# EAGLE schematic psu (EAGLE 7.4.0)
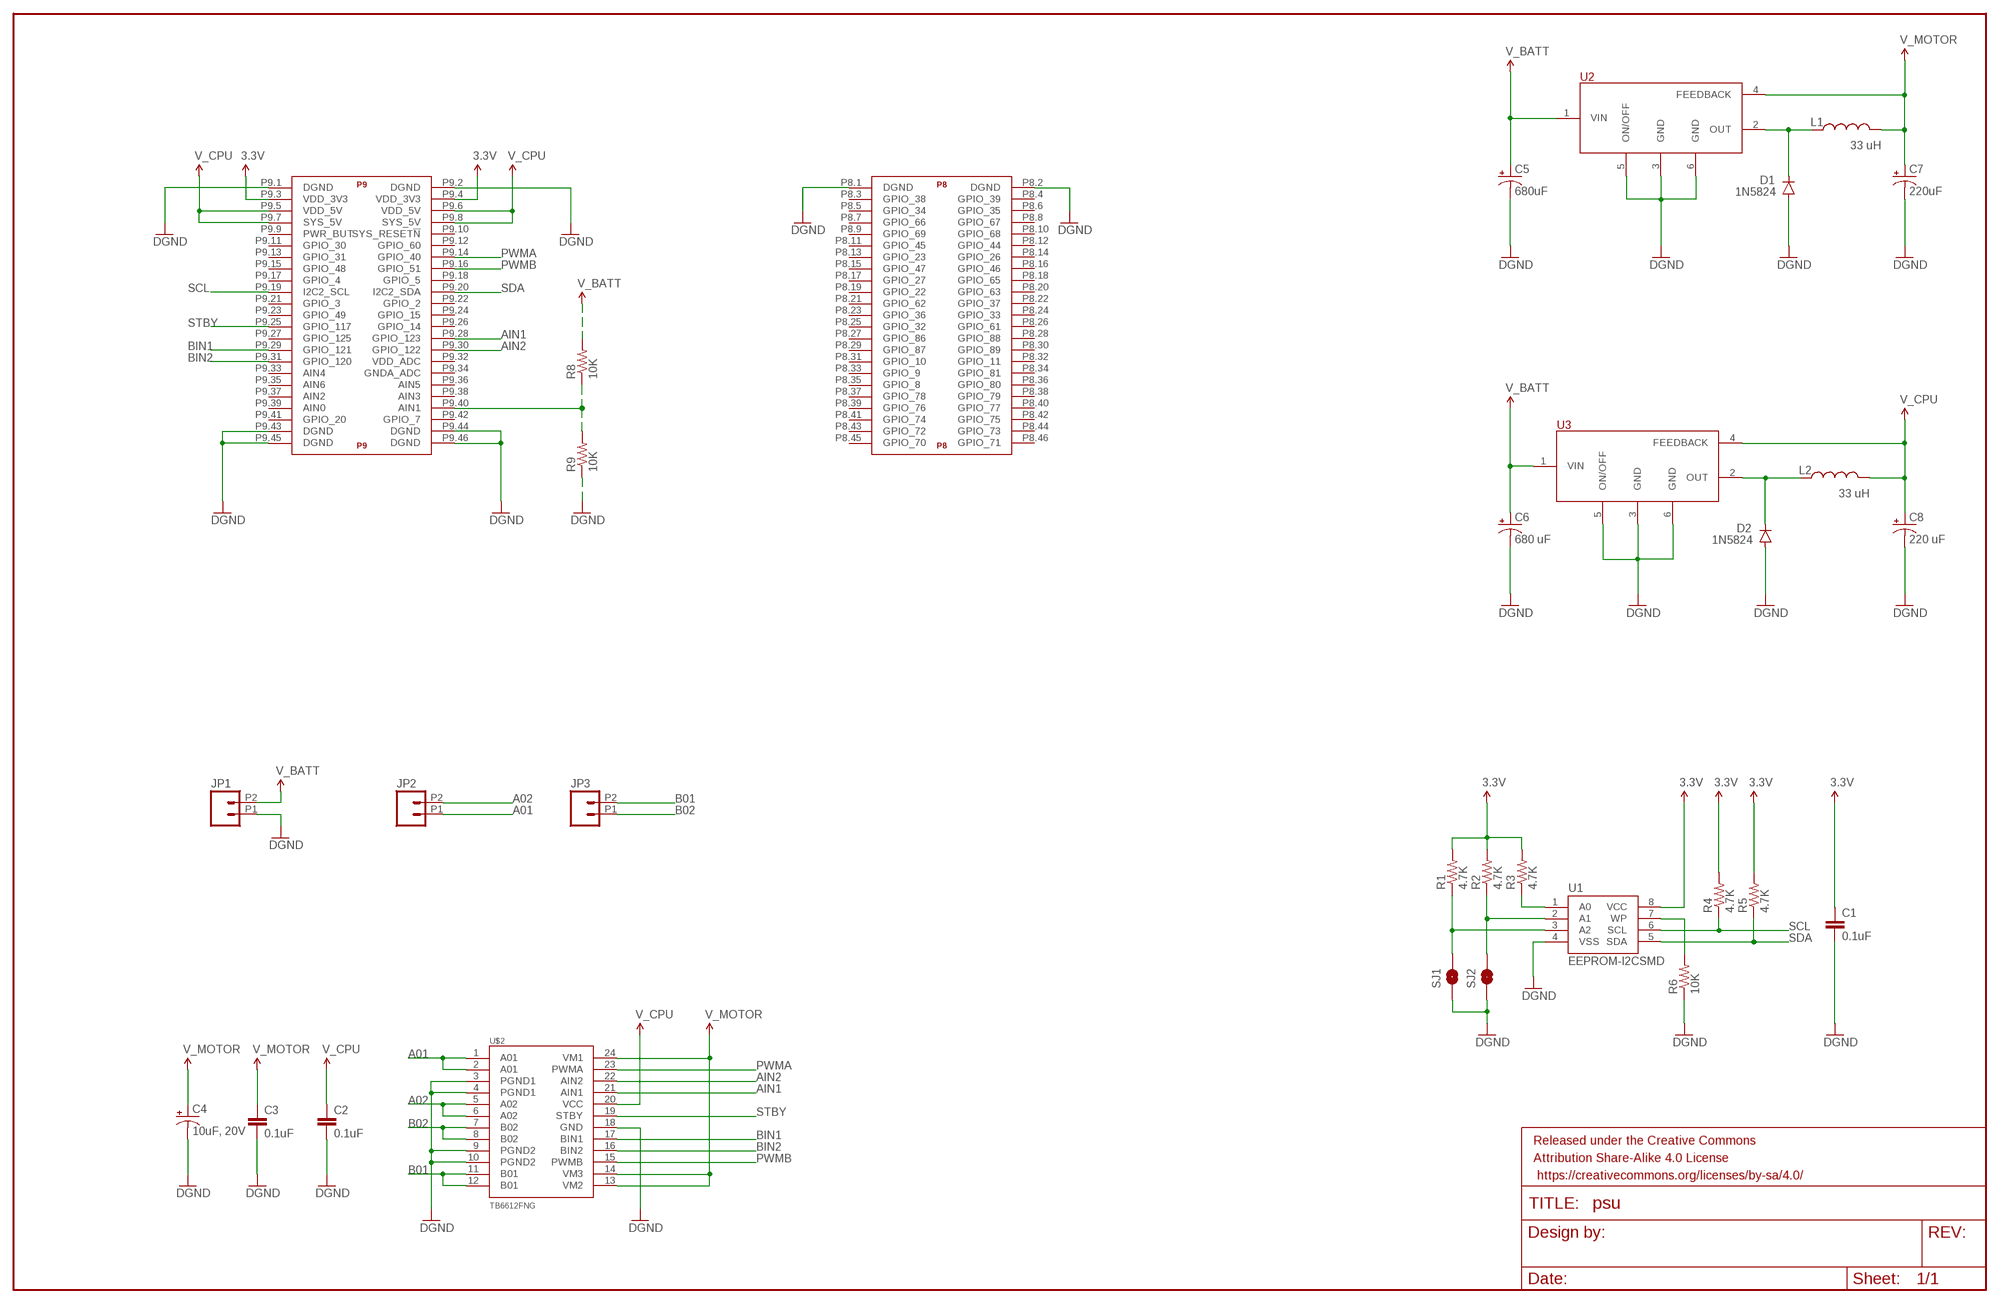
[diagram p0: schematic, sheet 1]

## Parts
C1  0.1uF  0.1UF-25V(+80/-20%)(0603)  [0603-CAP]
C2  0.1uF  0.1UF-25V(+80/-20%)(0603)  [0603-CAP]
C3  0.1uF  0.1UF-25V(+80/-20%)(0603)  [0603-CAP]
C4  10uF, 20V  10UF-25V-20%(PTH)KIT  [CPOL-RADIAL-10UF-25V-KIT]
C5  680uF  CAP_POLPTH2  [CPOL-RADIAL-10UF-25V]
C6  680 uF  CAP_POLPTH2  [CPOL-RADIAL-10UF-25V]
C7  220uF  CAP_POLPTH2  [CPOL-RADIAL-10UF-25V]
C8  220 uF  CAP_POLPTH2  [CPOL-RADIAL-10UF-25V]
D1  1N5824  DIODEPTH  [DIODE-1N4001]
D2  1N5824  DIODEPTH  [DIODE-1N4001]
FRAME2  FRAME-LEDGER  [CREATIVE_COMMONS]
JP1  M022.54MM_SCREWTERM  [1X02_2.54_SCREWTERM]
JP2  M022.54MM_SCREWTERM  [1X02_2.54_SCREWTERM]
JP3  M022.54MM_SCREWTERM  [1X02_2.54_SCREWTERM]
L1  33 uH  INDUCTOR0603  [0603]
L2  33 uH  INDUCTOR0603  [0603]
R1  4.7K  4.7KOHM-1/10W-1%(0603)  [0603-RES]
R2  4.7K  4.7KOHM-1/10W-1%(0603)  [0603-RES]
R3  4.7K  4.7KOHM-1/10W-1%(0603)  [0603-RES]
R4  4.7K  4.7KOHM-1/10W-1%(0603)  [0603-RES]
R5  4.7K  4.7KOHM-1/10W-1%(0603)  [0603-RES]
R6  10K  10KOHM-1/10W-1%(0603)0603  [0603-RES]
R8  10K  10KOHM-1/10W-1%(0603)0603  [0603-RES]
R9  10K  10KOHM-1/10W-1%(0603)0603  [0603-RES]
SJ1  JUMPER-PAD-2-NO  [PAD-JUMPER-2-NO_NO_SILK]
SJ2  JUMPER-PAD-2-NO  [PAD-JUMPER-2-NO_NO_SILK]
U1  EEPROM-I2CSMD  [SO08]
U2  LM2596  [TO-263]
U3  LM2596  [TO-263]
U$1  BEAGLE_BONE_BLACK_CAPE  [BEAGLE_BONE_BLACK_CAPE]
U$2  TB6612FNG  [SSOP24]

## Nets
3.3V: C1.1 R1.2 R2.2 R3.2 R4.2 R5.2 U1.8(VCC) U$1.P9.3(P9:VDD_3V3) U$1.P9.4(P9:VDD_3V3)
A01: JP2.P1 U$2.1(A01) U$2.2(A01)
A02: JP2.P2 U$2.5(A02) U$2.6(A02)
AIN1: U$1.P9.28(P9:GPIO_123) U$2.21(AIN1)
AIN2: U$1.P9.30(P9:GPIO_122) U$2.22(AIN2)
B01: JP3.P2 U$2.11(B01) U$2.12(B01)
B02: JP3.P1 U$2.7(B02) U$2.8(B02)
BIN1: U$1.P9.29(P9:GPIO_121) U$2.17(BIN1)
BIN2: U$1.P9.31(P9:GPIO_120) U$2.16(BIN2)
GND: C1.2 C2.2 C3.2 C4.2(-) C5.2(-) C6.2(-) C7.2(-) C8.2(-) D1.A D2.A JP1.P1 R6.1 R9.1 SJ1.1 SJ2.1 U1.4(VSS) U2.3(GND) U2.5(ON/OFF) U2.6(GND) U3.3(GND) U3.5(ON/OFF) U3.6(GND) U$1.P8.1(P8:DGND) U$1.P8.2(P8:DGND) U$1.P9.1(P9:DGND) U$1.P9.2(P9:DGND) U$1.P9.43(P9:DGND) U$1.P9.44(P9:DGND) U$1.P9.45(P9:DGND) U$1.P9.46(P9:DGND) U$2.3(PGND1) U$2.4(PGND1) U$2.9(PGND2) U$2.10(PGND2) U$2.18(GND) ; supply symbol labelled DGND
N$1: R3.1 U1.1(A0)
N$2: R2.1 SJ2.2 U1.2(A1)
N$3: R1.1 SJ1.2 U1.3(A2)
N$4: R8.1 R9.2 U$1.P9.40(P9:AIN1)
N$5: R6.2 U1.7(WP)
N$8: D1.C L1.1 U2.2(OUT)
N$9: D2.C L2.1 U3.2(OUT)
PWMA: U$1.P9.14(P9:GPIO_40) U$2.23(PWMA)
PWMB: U$1.P9.16(P9:GPIO_51) U$2.15(PWMB)
SCL: R4.1 U1.6(SCL) U$1.P9.19(P9:I2C2_SCL)
SDA: R5.1 U1.5(SDA) U$1.P9.20(P9:I2C2_SDA)
STBY: U$1.P9.25(P9:GPIO_117) U$2.19(STBY)
V_BATT: C5.1(+) C6.1(+) JP1.P2 R8.2 U2.1(VIN) U3.1(VIN)
V_CPU: C2.1 C8.1(+) L2.2 U3.4(FEEDBACK) U$1.P9.5(P9:VDD_5V) U$1.P9.6(P9:VDD_5V) U$1.P9.7(P9:SYS_5V) U$1.P9.8(P9:SYS_5V) U$2.20(VCC)
V_MOTOR: C3.1 C4.1(+) C7.1(+) L1.2 U2.4(FEEDBACK) U$2.13(VM2) U$2.14(VM3) U$2.24(VM1)
Unconnected: U$1.P8.3(P8:GPIO_38) U$1.P8.4(P8:GPIO_39) U$1.P8.5(P8:GPIO_34) U$1.P8.6(P8:GPIO_35) U$1.P8.7(P8:GPIO_66) U$1.P8.8(P8:GPIO_67) U$1.P8.9(P8:GPIO_69) U$1.P8.10(P8:GPIO_68) U$1.P8.11(P8:GPIO_45) U$1.P8.12(P8:GPIO_44) U$1.P8.13(P8:GPIO_23) U$1.P8.14(P8:GPIO_26) U$1.P8.15(P8:GPIO_47) U$1.P8.16(P8:GPIO_46) U$1.P8.17(P8:GPIO_27) U$1.P8.18(P8:GPIO_65) U$1.P8.19(P8:GPIO_22) U$1.P8.20(P8:GPIO_63) U$1.P8.21(P8:GPIO_62) U$1.P8.22(P8:GPIO_37) U$1.P8.23(P8:GPIO_36) U$1.P8.24(P8:GPIO_33) U$1.P8.25(P8:GPIO_32) U$1.P8.26(P8:GPIO_61) U$1.P8.27(P8:GPIO_86) U$1.P8.28(P8:GPIO_88) U$1.P8.29(P8:GPIO_87) U$1.P8.30(P8:GPIO_89) U$1.P8.31(P8:GPIO_10) U$1.P8.32(P8:GPIO_11) U$1.P8.33(P8:GPIO_9) U$1.P8.34(P8:GPIO_81) U$1.P8.35(P8:GPIO_8) U$1.P8.36(P8:GPIO_80) U$1.P8.37(P8:GPIO_78) U$1.P8.38(P8:GPIO_79) U$1.P8.39(P8:GPIO_76) U$1.P8.40(P8:GPIO_77) U$1.P8.41(P8:GPIO_74) U$1.P8.42(P8:GPIO_75) U$1.P8.43(P8:GPIO_72) U$1.P8.44(P8:GPIO_73) U$1.P8.45(P8:GPIO_70) U$1.P8.46(P8:GPIO_71) U$1.P9.9(P9:PWR_BUT) U$1.P9.10(P9:SYS_RESET!N) U$1.P9.11(P9:GPIO_30) U$1.P9.12(P9:GPIO_60) U$1.P9.13(P9:GPIO_31) U$1.P9.15(P9:GPIO_48) U$1.P9.17(P9:GPIO_4) U$1.P9.18(P9:GPIO_5) U$1.P9.21(P9:GPIO_3) U$1.P9.22(P9:GPIO_2) U$1.P9.23(P9:GPIO_49) U$1.P9.24(P9:GPIO_15) U$1.P9.26(P9:GPIO_14) U$1.P9.27(P9:GPIO_125) U$1.P9.32(P9:VDD_ADC) U$1.P9.33(P9:AIN4) U$1.P9.34(P9:GNDA_ADC) U$1.P9.35(P9:AIN6) U$1.P9.36(P9:AIN5) U$1.P9.37(P9:AIN2) U$1.P9.38(P9:AIN3) U$1.P9.39(P9:AIN0) U$1.P9.41(P9:GPIO_20) U$1.P9.42(P9:GPIO_7)

## Library data of the parts
C1-C3 = SparkFun-Capacitors:0.1UF-25V(+80/-20%)(0603): CAP-00810 Ceramic Standard decoupling cap; PROD_ID: CAP-00810
C4 = SparkFun-Capacitors:10UF-25V-20%(PTH): CAP-08440; PROD_ID: CAP-08440
C5-C8 = SparkFun-Capacitors:CAP_POL: Capacitor Polarized These are standard SMD and PTH capacitors. Normally 10uF, 47uF, and 100uF in electrolytic and tantalum varieties. Always verify the external diameter of the through hole cap, it varies with capacity, voltage, and manufacturer. The EIA devices should be standard.
D1 D2 = SparkFun-DiscreteSemi:DIODE: Diode These are standard reverse protection diodes and small signal diodes. SMA package can handle up to about 1A. SOD-323 can handle about 200mA. What the SOD-323 package when ordering, there are some mfgs out there that are 5-pin packages.
FRAME2 = SparkFun-Aesthetics:FRAME-LEDGER: Schematic Frame Standard 11x14 US Ledger frame
JP1-JP3 = SparkFun-Connectors:M02: Standard 2-pin 0.1" header. Use with - straight break away headers ( PRT-00116) - right angle break away headers (PRT-00553) - swiss pins (PRT-00743) - machine pins (PRT-00117) - female headers (PRT-00115) Molex polarized connector foot print use with: PRT-08233 with associated crimp pins and housings. 2.54_SCREWTERM for use with PRT-10571. 3.5mm Screw Terminal footprints for PRT-08084 5mm Screw Terminal footprints for use with PRT-08432
L1 L2 = SparkFun-Passives:INDUCTOR: Inductors Basic Inductor/Choke - 0603 and 1206. Footprints are not proven and vary greatly between part numbers. INDUCTOR POWER 3.3UH 4.0A SMD 0.197" L x 0.197" W x 0.177" H (5.00mm x 5.00mm x 4.50mm)
R1-R5 = SparkFun-Resistors:4.7KOHM-1/10W-1%(0603): RES-07857; PROD_ID: RES-07857
R6 R8 R9 = SparkFun-Resistors:10KOHM-1/10W-1%(0603): RES-00824; PROD_ID: RES-00824
SJ1 SJ2 = SparkFun-Passives:JUMPER-PAD-2-NO
U1 = SparkFun-DigitalIC:EEPROM-I2C: I2C EEPROM chips, 24LC256 (and others)
U2 U3 = psu:LM2596: TI Buck converter
U$1 = SparkFun-Boards:BEAGLE_BONE_BLACK_CAPE
U$2 = SparkFun-PowerIC:TB6612FNG: Toshiba 1A dual motor driver IC-09363; PROD_ID: IC-09363